# Altium schematic sheet Э4_2.SchDoc
size 420 x 297 mm; DocumentNumber: АЕСН.464419.008Э4; SheetNumber: 2; PERVICH_PRIM: АЕСН.464419.008Э4
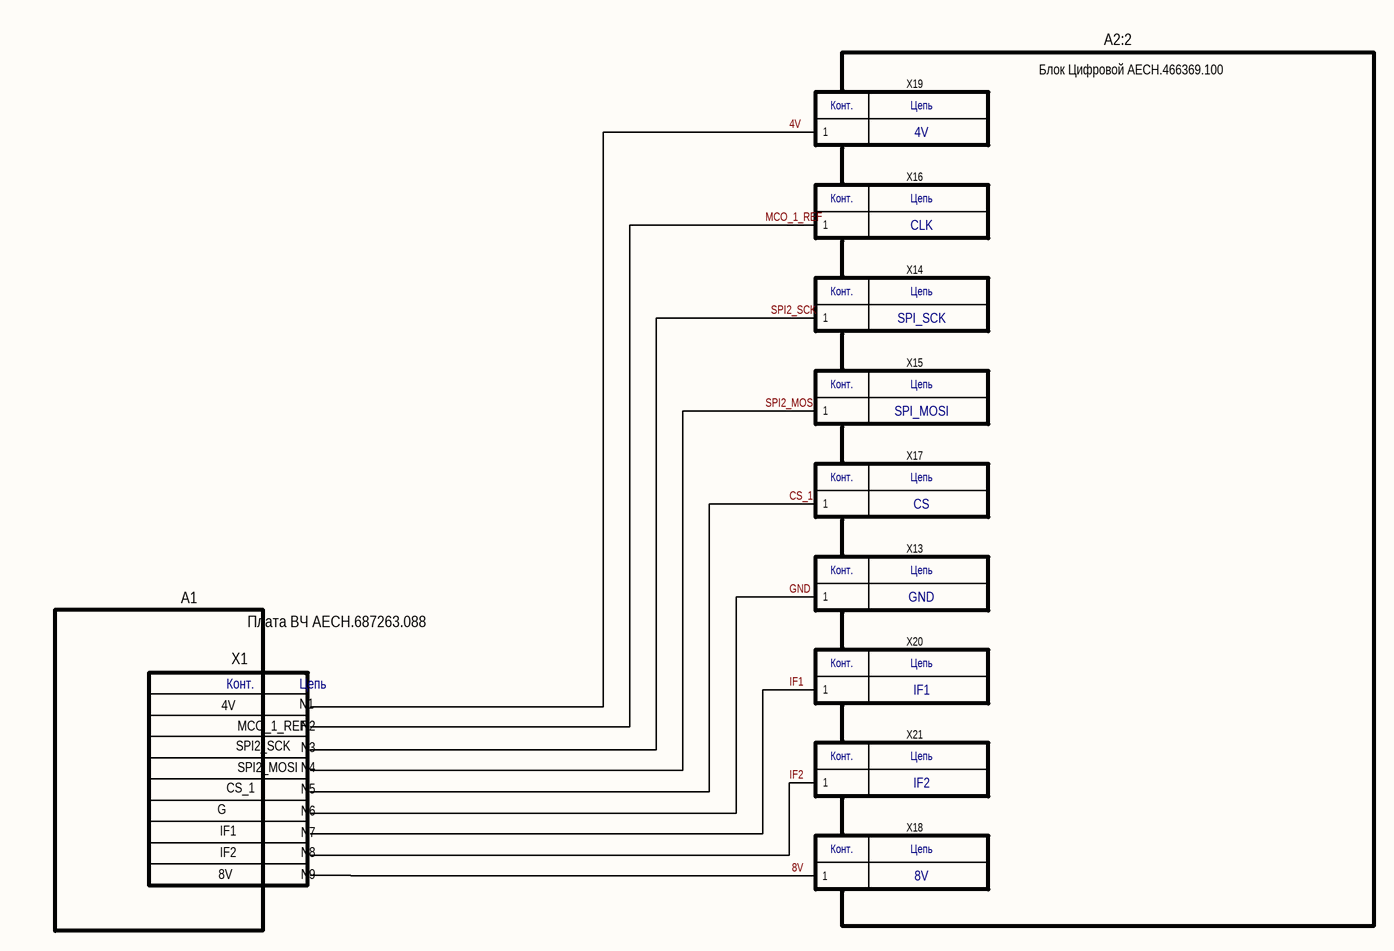
[diagram p0: Э4_2.SchDoc]

## Parts
*?  A1-Плата ВЧ  (value not drawn)
X13  1pin  [lam 4x2]  (value not drawn)
X14  1pin  [lam 4x2]  (value not drawn)
X15  1pin  [lam 4x2]  (value not drawn)
X16  1pin  [lam 4x2]  (value not drawn)
X17  1pin  [lam 4x2]  (value not drawn)
X18  1pin  [lam 4x2]  (value not drawn)
X19  1pin  [lam 4x2]  (value not drawn)
X20  1pin  [lam 4x2]  (value not drawn)
X21  1pin  [lam 4x2]  (value not drawn)

## Nets
4V: *?.8 X19.1
CS_1: *?.4 X17.1
GND: *?.3 X13.1
IF1: *?.2 X20.1
IF2: *?.1 X21.1
MCO_1_REF: *?.7 X16.1
SPI2_MOSI: *?.5 X15.1
SPI2_SCK: *?.6 X14.1
Net*?_0: *?.0 X18.1

## Notes on the sheet
- A2:2
- 4V
- Блок Цифровой АЕСН.466369.100
- CLK
- SPI_SCK
- SPI_MOSI
- CS
- GND
- A1
- X1
- Плата ВЧ АЕСН.687263.088
- IF1
- IF2
- 8V
- Labels drawn without touching a wire or pin: 8V
- Подп. и дата
- Инв.№ дубл.
- Взам. инв. №
- Инв № подл.
- Изм.
- Лист
- № докум.
- Подп.
- Дата
- Копировал
- Формат А3
- (in symbol 1pin) Конт.; Цепь
- (in symbol A1-Плата ВЧ) Конт.; Цепь; 4V; N1; MCO_1_REF; N2; SPI2_SCK; N3; SPI2_MOSI; N4; CS_1; N5; G; N6; IF1; N7; IF2; N8; 8V; N9

## Library data of the parts
X13-X21 = 1pin: Manufacturer: *; PartNumber: *